# EAGLE design KDAC (EAGLE 9.6.2)
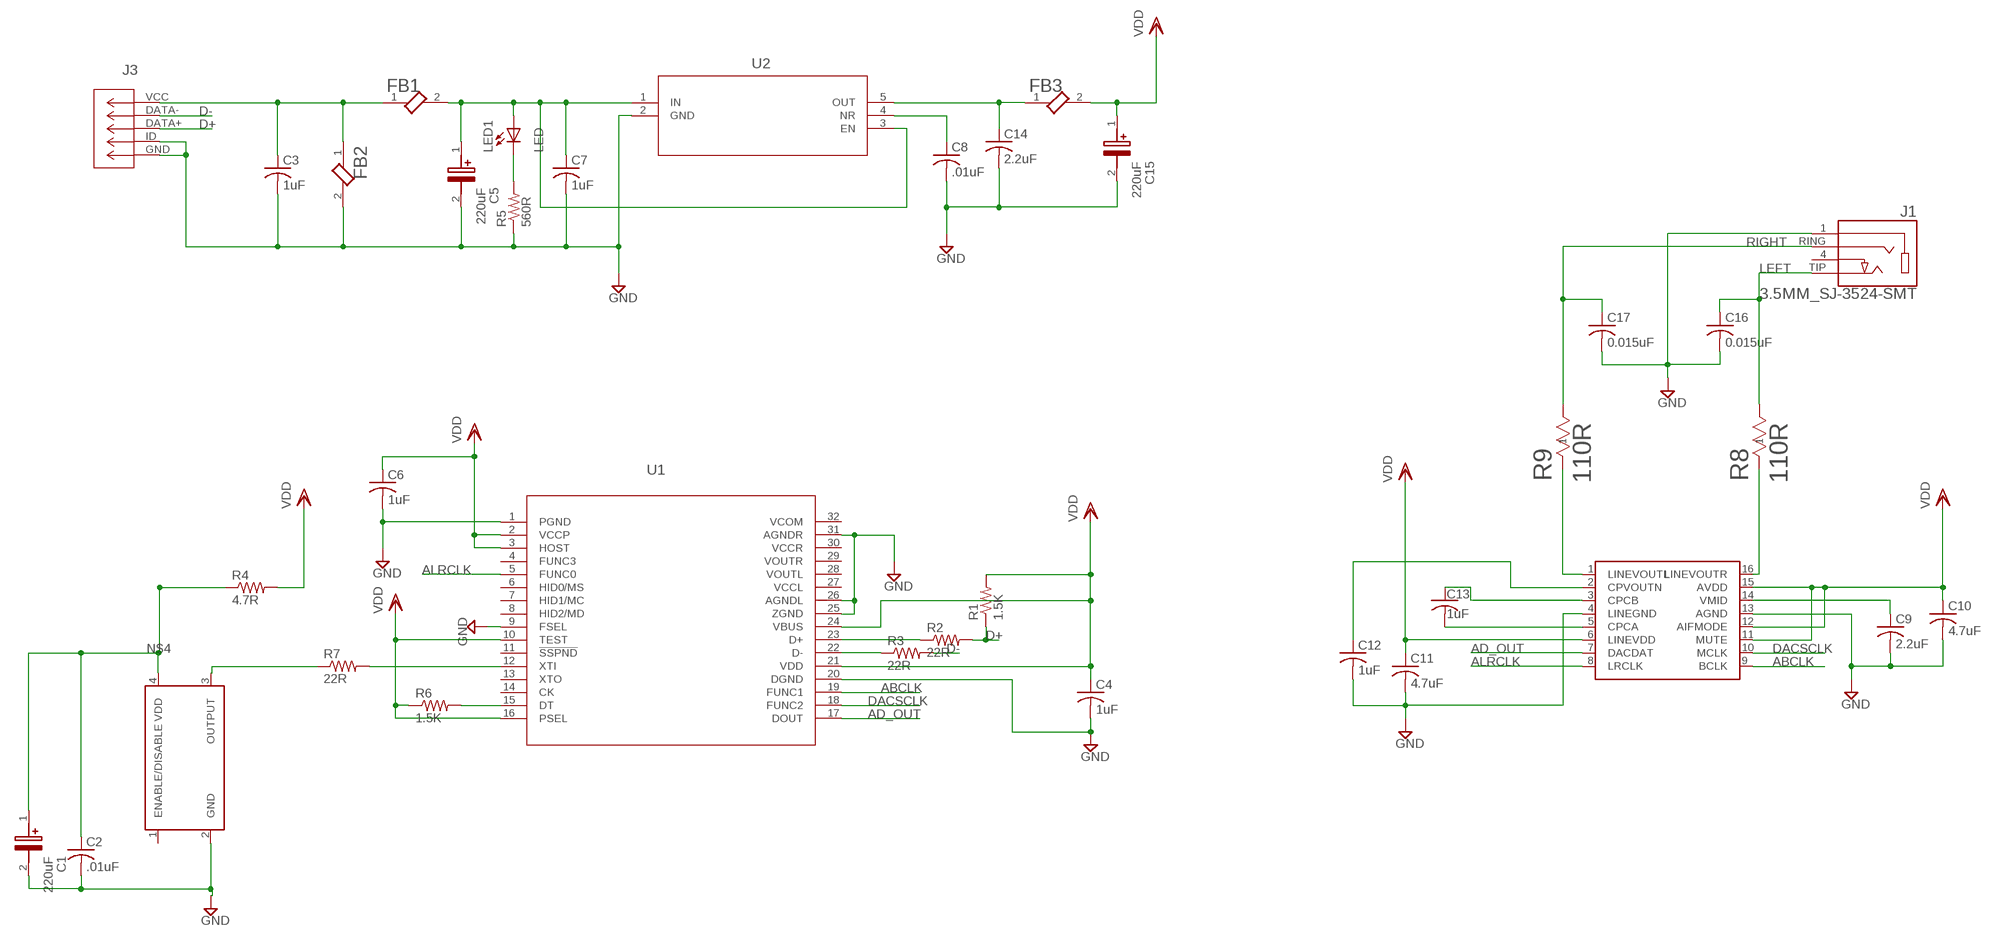
[diagram p0: schematic, sheet 1]

## Parts
C1  220uF  EEE-1VA221UP  [CAPAE830X1050N]
C2  .01uF  C-USC0805  [C0805]
C3  1uF  C-USC0805  [C0805]
C4  1uF  C-USC0805  [C0805]
C5  220uF  EEE-1VA221UP  [CAPAE830X1050N]
C6  1uF  C-USC0805  [C0805]
C7  1uF  C-USC0805  [C0805]
C8  .01uF  C-USC0805  [C0805]
C9  2.2uF  C-USC0805  [C0805]
C10  4.7uF  C-USC0805  [C0805]
C11  4.7uF  C-USC0805  [C0805]
C12  1uF  C-USC0805  [C0805]
C13  1uF  C-USC0805  [C0805]
C14  2.2uF  C-USC0805  [C0805]
C15  220uF  EEE-1VA221UP  [CAPAE830X1050N]
C16  0.015uF  C-US050-075X075  [C050-075X075]
C17  0.015uF  C-US050-075X075  [C050-075X075]
FB1  L_MURATA_BLM31PG601SN1LMURATA_BLM31PG601SN1L_0_2  [MURATA_BLM31PG601SN1L_2]
FB2  L_MURATA_BLM31PG601SN1LMURATA_BLM31PG601SN1L_0_2  [MURATA_BLM31PG601SN1L_2]
FB3  L_MURATA_BLM31PG601SN1LMURATA_BLM31PG601SN1L_0_2  [MURATA_BLM31PG601SN1L_2]
J1  3.5MM_SJ-3524-SMT  [CUI_SJ-3524-SMT]
J3  USB-MICRO-B_10118192-0002LF  [CONN_10118192-0002LF_AMP]
LED1  LED  [LED_2.54MM_0.5MM]
R1  1.5K  R-US_R1206  [R1206]
R2  22R  R-US_R1206  [R1206]
R3  22R  R-US_R1206  [R1206]
R4  4.7R  R-US_R1206  [R1206]
R5  560R  R-US_R1206  [R1206]
R6  1.5K  R-US_R1206  [R1206]
R7  22R  R-US_R1206  [R1206]
R8  110R  R_CMF50110R00FHEB  [RES_CMF50]
R9  110R  R_CMF50110R00FHEB  [RES_CMF50]
U1  PCM2706CPJTRPJT32-M  [PJT32-M]
U2  TPS79333DBVRDBV5_TEX-M  [DBV5_TEX-M]
U3  WM8524ALT  [SOP65P640X110-16N]
X1  ASV-12MHZ  [ASV_12MHZ_4SMD-M]

## Nets
ABCLK [Signal]: U1.19(FUNC1) U3.9(BCLK)
AD_OUT [Signal]: U1.17(DOUT) U3.7(DACDAT)
ALRCLK [Signal]: U1.5(FUNC0) U3.8(LRCLK)
D+ [Signal]: J3.DATA+ R1.1 R2.2
D- [Signal]: J3.DATA- R3.2
DACSCLK [Signal]: U1.18(FUNC2) U3.10(MCLK)
GND [PWR]: C1.2(-) C2.2 C3.2 C4.2 C5.2(-) C6.2 C7.2 C8.2 C9.2 C10.2 C11.2 C12.2 C14.2 C15.2(-) C16.2 C17.2 FB2.2 J1.1 J3.GND J3.ID R5.1 U1.1(PGND) U1.9(FSEL) U1.20(DGND) U1.25(ZGND) U1.26(AGNDL) U1.31(AGNDR) U2.2(GND) U3.4(LINEGND) U3.13(AGND) X1.2(GND)
LEFT [PWR]: C16.1 J1.TIP R8.2
N$1: C3.1 FB1.1 FB2.1 J3.VCC
N$2 [Signal]: C14.1 FB3.1 U2.5(OUT)
N$3 [Signal]: C5.1(+) C7.1 FB1.2 LED1.ANODE(+) U2.1(IN) U2.3(EN)
N$4 [Signal]: C1.1(+) C2.1 R4.1 X1.4(VDD)
N$5 [Signal]: R7.2 U1.12(XTI)
N$6 [Signal]: R7.1 X1.3(OUTPUT)
N$7 [Signal]: LED1.CATHODE(-) R5.2
N$8 [Signal]: C8.1 U2.4(NR)
N$9 [Signal]: R6.2 U1.15(DT)
N$10 [Signal]: R3.1 U1.22(D-)
N$11 [Signal]: R2.1 U1.23(D+)
N$12 [Signal]: C13.1 U3.3(CPCB)
N$13 [Signal]: C12.1 U3.2(CPVOUTN)
N$14 [Signal]: C9.1 U3.14(VMID)
N$15 [Signal]: C13.2 U3.5(CPCA)
N$16 [PWR]: R9.1 U3.1(LINEVOUTL)
N$17 [PWR]: R8.1 U3.16(LINEVOUTR)
RIGHT [PWR]: C17.1 J1.RING R9.2
VDD [PWR]: C4.1 C6.1 C10.1 C11.1 C15.1(+) FB3.2 R1.2 R4.2 R6.1 U1.2(VCCP) U1.3(HOST) U1.10(TEST) U1.16(PSEL) U1.21(VDD) U1.24(VBUS) U3.6(LINEVDD) U3.11(MUTE) U3.12(AIFMODE) U3.15(AVDD)
Unconnected: J1.4 U1.4(FUNC3) U1.6(HID0/MS) U1.7(HID1/MC) U1.8(HID2/MD) U1.11(!SSPND) U1.13(XTO) U1.14(CK) U1.28(VOUTL) U1.29(VOUTR) X1.1(ENABLE/DISABLE)

## Power pins joined to a net without a drawn wire
VCCL: U1.27(VCCL)
VCCR: U1.30(VCCR)
VCOM: U1.32(VCOM)

## Library data of the parts
C1 C5 C15 = GrubDAC:EEE-1VA221UP: PANASONIC ELECTRONIC COMPONENTS - EEE-1VA221UP - ALUMINUM ELECTROLYTIC CAPACITOR, 220UF, 35V, 20%, SMD Source: Datasheet <http://www.farnell.com/datasheets/1909355.pdf?_ga=1.185853408.878552343.1493119789>; ARROW_PART_NUMBER: EEE-1VA221UP; ARROW_PRICE-STOCK: https://www.arrow.com/en/products/eee1va221up/panasonic; DESCRIPTION: PANASONIC ELECTRONIC COMPONENTS - EEE-1VA221UP - ALUMINUM ELECTROLYTIC CAPACITOR, 220UF, 35V, 20%, SMD; HEIGHT: 10.5mm; MANUFACTURER_NAME: Panasonic; MANUFACTURER_PART_NUMBER: EEE-1VA221UP; MOUSER_PART_NUMBER: 667-EEE-1VA221UP; MOUSER_PRICE-STOCK: https://www.mouser.co.uk/ProductDetail/Panasonic/EEE-1VA221UP?qs=wEytwf7f49HAk5ZYHhDyew%3D%3D
C2-C4 C6-C14 C16 C17 = GrubDAC:C-US: CAPACITOR, American symbol
FB1-FB3 = GrubDAC:L_MURATA_BLM31PG601SN1L: Ferrite Beads Multi-Layer 600Ohm 25% 100MHz 1.5A 80mOhm DCR 1206 Embossed T/R; 3DS_PART_NUMBER: 310-00005; AUTOMOTIVE: No; CENTROID_NOT_SPECIFIED: No; CORE_MATERIAL: Ferrite; DATASHEET: https://www.murata.com/en-us/products/productdata/8796739698718/ENFA0006.pdf; DEVICE_CLASS_L1: Passive Components; DEVICE_CLASS_L2: EMI / RFI Components; DEVICE_CLASS_L3: Ferrite Beads and Chips; DIGIKEY_DESCRIPTION: FBEAD FERRITE BEAD 600 OHM 1206 1LN; DIGIKEY_PART_NUMBER: 490-1057-1-ND; FOOTPRINT_PARAMETERS_0: {"fp_type":"chip_res","params":{"L":{"nom":3200000,"long name":"Length","min":3000000,"max":3400000,"short name":"L","type":"measurement"},"W":{"nom":1600000,"long name":"Width","min":1400000,"max":1800000,"short name":"W","type":"measurement"},"t":{"nom":1100000,"long name":"Height","min":900000,"max":1300000,"short name":"t","type":"measurement"},"b":{"nom":700000,"long name":"Terminal width","min":400000,"max":1000000,"short name":"b","type":"measurement"},"P":{"default":"false","long name":"Polarized","type":"multichoice","short name":"P"},"offset x":{"nom":0,"long name":"X Center offset","min":null,"max":null,"short name":"offset x","type":"measurement"},"offset y":{"nom":0,"long name":"Y Center offset","min":null,"max":null,"short name":"offset y","type":"measurement"},"LS":{"long name":"Land shape","type":"fixed","short name":"LS","value":"Rectangle"},"solder toe":{"nom":550000,"long name":"Solder fillet (toe)","min":null,"max":null,"short name":"solder toe","type":"fixedmeasurement"},"solder heel":{"nom":-50000,"long name":"Solder fillet (heel)","min":null,"max":null,"short name":"solder heel","type":"fixedmeasurement"},"solder side":{"nom":50000,"long name":"Solder fillet (side)","min":null,"max":null,"short name":"solder side","type":"fixedmeasurement"},"courtyard":{"nom":500000,"long name":"Courtyard","min":null,"max":null,"short name":"courtyard","type":"fixedmeasurement"},"SF":{"default":"A (>= 1608 metric)","long name":"Packing level","type":"multichoiceparent","short name":"SF","help":"http://support.upverter.com/customer/portal/articles/978783-what-is-a-footprint-packing-level","children":["solder toe","solder heel","solder side","courtyard"]}}}; FOOTPRINT_PARAMETERS_1: {"fp_type":"chip_res","params":{"L":{"nom":3200000,"long name":"Length","min":3000000,"max":3400000,"short name":"L","type":"measurement"},"W":{"nom":1600000,"long name":"Width","min":1400000,"max":1800000,"short name":"W","type":"measurement"},"t":{"nom":1100000,"long name":"Height","min":900000,"max":1300000,"short name":"t","type":"measurement"},"b":{"nom":700000,"long name":"Terminal width","min":400000,"max":1000000,"short name":"b","type":"measurement"},"P":{"default":"false","long name":"Polarized","type":"multichoice","short name":"P"},"offset x":{"nom":0,"long name":"X Center offset","min":null,"max":null,"short name":"offset x","type":"measurement"},"offset y":{"nom":0,"long name":"Y Center offset","min":null,"max":null,"short name":"offset y","type":"measurement"},"LS":{"long name":"Land shape","type":"fixed","short name":"LS","value":"Rectangle"},"solder toe":{"nom":550000,"long name":"Solder fillet (toe)","min":null,"max":null,"short name":"solder toe","type":"fixedmeasurement"},"solder heel":{"nom":0,"long name":"Solder fillet (heel)","min":null,"max":null,"short name":"solder heel","type":"fixedmeasurement"},"solder side":{"nom":50000,"long name":"Solder fillet (side)","min":null,"max":null,"short name":"solder side","type":"fixedmeasurement"},"courtyard":{"nom":500000,"long name":"Courtyard","min":null,"max":null,"short name":"courtyard","type":"fixedmeasurement"},"SF":{"default":"A (>= 1608 metric)","long name":"Packing level","type":"multichoiceparent","short name":"SF","help":"http://support.upverter.com/customer/portal/articles/978783-what-is-a-footprint-packing-level","children":["solder toe","solder heel","solder side","courtyard"]}}}; FOOTPRINT_PARAMETERS_2: {"fp_type":"chip_res","params":{"L":{"nom":3200000,"long name":"Length","min":3000000,"max":3400000,"short name":"L","type":"measurement"},"W":{"nom":1600000,"long name":"Width","min":1400000,"max":1800000,"short name":"W","type":"measurement"},"t":{"nom":1100000,"long name":"Height","min":900000,"max":1300000,"short name":"t","type":"measurement"},"b":{"nom":700000,"long name":"Terminal width","min":400000,"max":1000000,"short name":"b","type":"measurement"},"P":{"default":"false","long name":"Polarized","type":"multichoice","short name":"P"},"offset x":{"nom":0,"long name":"X Center offset","min":null,"max":null,"short name":"offset x","type":"measurement"},"offset y":{"nom":0,"long name":"Y Center offset","min":null,"max":null,"short name":"offset y","type":"measurement"},"LS":{"long name":"Land shape","type":"fixed","short name":"LS","value":"Rectangle"},"solder toe":{"nom":350000,"long name":"Solder fillet (toe)","min":null,"max":null,"short name":"solder toe","type":"fixedmeasurement"},"solder heel":{"nom":0,"long name":"Solder fillet (heel)","min":null,"max":null,"short name":"solder heel","type":"fixedmeasurement"},"solder side":{"nom":0,"long name":"Solder fillet (side)","min":null,"max":null,"short name":"solder side","type":"fixedmeasurement"},"courtyard":{"nom":250000,"long name":"Courtyard","min":null,"max":null,"short name":"courtyard","type":"fixedmeasurement"},"SF":{"default":"B (>= 1608 metric)","long name":"Packing level","type":"multichoiceparent","short name":"SF","help":"http://support.upverter.com/customer/portal/articles/978783-what-is-a-footprint-packing-level","children":["solder toe","solder heel","solder side","courtyard"]}}}; FOOTPRINT_PARAMETERS_3: {"fp_type":"chip_res","params":{"L":{"nom":3200000,"long name":"Length","min":3000000,"max":3400000,"short name":"L","type":"measurement"},"W":{"nom":1600000,"long name":"Width","min":1400000,"max":1800000,"short name":"W","type":"measurement"},"t":{"nom":1100000,"long name":"Height","min":900000,"max":1300000,"short name":"t","type":"measurement"},"b":{"nom":700000,"long name":"Terminal width","min":400000,"max":1000000,"short name":"b","type":"measurement"},"P":{"default":"false","long name":"Polarized","type":"multichoice","short name":"P"},"offset x":{"nom":0,"long name":"X Center offset","min":null,"max":null,"short name":"offset x","type":"measurement"},"offset y":{"nom":0,"long name":"Y Center offset","min":null,"max":null,"short name":"offset y","type":"measurement"},"LS":{"long name":"Land shape","type":"fixed","short name":"LS","value":"Rectangle"},"solder toe":{"nom":150000,"long name":"Solder fillet (toe)","min":null,"max":null,"short name":"solder toe","type":"fixedmeasurement"},"solder heel":{"nom":0,"long name":"Solder fillet (heel)","min":null,"max":null,"short name":"solder heel","type":"fixedmeasurement"},"solder side":{"nom":-50000,"long name":"Solder fillet (side)","min":null,"max":null,"short name":"solder side","type":"fixedmeasurement"},"courtyard":{"nom":100000,"long name":"Courtyard","min":null,"max":null,"short name":"courtyard","type":"fixedmeasurement"},"SF":{"default":"C (>= 1608 metric)","long name":"Packing level","type":"multichoiceparent","short name":"SF","help":"http://support.upverter.com/customer/portal/articles/978783-what-is-a-footprint-packing-level","children":["solder toe","solder heel","solder side","courtyard"]}}}; FOOTPRINT_VARIANT_NAME_0: Recommended_Land_Pattern; FOOTPRINT_VARIANT_NAME_1: IPC_A; FOOTPRINT_VARIANT_NAME_2: IPC_B; FOOTPRINT_VARIANT_NAME_3: IPC_C; HEIGHT: 1.3mm; IMPEDANCE_AT_FREQUENCY: 600Ω @ 100MHz; IPC_LAND_PATTERN_NAME: CAPC320160X110; LEAD_FREE: Yes; MF: Murata; MFG_PACKAGE_IDENT: BLM31PG; MFG_PACKAGE_IDENT_DATE: 0; MFG_PACKAGE_IDENT_REV: 0; MOUSER_PART_NUMBER: 81-BLM31PG601SN1; MPN: BLM31PG601SN1L; PACKAGE: 1206; PREFIX: FB; RMS_CURRENT: 1.5A; ROHS: Yes; SERIES_RESISTANCE: 0.08Ω; TEMPERATURE_RANGE_HIGH: +125°C; TEMPERATURE_RANGE_LOW: -55°C; TEST_FREQUENCY: 100MHz; TOLERANCE: 25%; VERIFICATION_VERSION: 0.0.0.2
J1 = GrubDAC:3.5MM_SJ-3524-SMT: Audio Jack Connector 3.5 mm Low Profile Surface Mount Stereo Jack, 4 Pin Right-Angle; MF: CUI Inc; PARTREV: 1.03; STANDARD: Manufacturer recommendations
J3 = GrubDAC:USB-MICRO-B_10118192-0002LF; BUILT_BY: EMA_Cory; COPYRIGHT: Copyright (C) 2018 Accelerated Designs. All rights reserved; DATASHEET: https://www.amphenol-icc.com/media/wysiwyg/files/drawing/10118192.pdf; MANUFACTURER_PART_NUMBER: 10118192-0002LF; SOURCELIBRARY: Amphenol_ICC_2020-05-19; VENDOR: Amphenol
LED1 = GrubDAC:LED
R1-R7 = GrubDAC:R-US_: RESISTOR, American symbol
R8 R9 = GrubDAC:R_CMF50110R00FHEB; BUILT_BY: EMA_UL_Team; MANUFACTURER_PART_NUMBER: CMF50110R00FHEB; VENDOR: Vishay
U1 = GrubDAC:PCM2706CPJTR; BUILT_BY: EMA_UL_Team; MANUFACTURER: Texas Instruments; MANUFACTURER_PART_NUMBER: PCM2706CPJTR; VENDOR: Texas Instruments
U2 = GrubDAC:TPS79333DBVR; BUILT_BY: EMA_UL_Team; MANUFACTURER: Texas Instruments; MANUFACTURER_PART_NUMBER: TPS79333DBVR; SOURCELIBRARY: TI_2014-06-19; VENDOR: Texas Instruments
U3 = GrubDAC:WM8524
X1 = GrubDAC:ASV-12MHZ

## Net classes
0 default: width 0.203 mm, clearance 0.178 mm
1 Signal: width 0.203 mm, clearance 0.178 mm
2 PWR: width 0.406 mm, clearance 0.178 mm

## Board
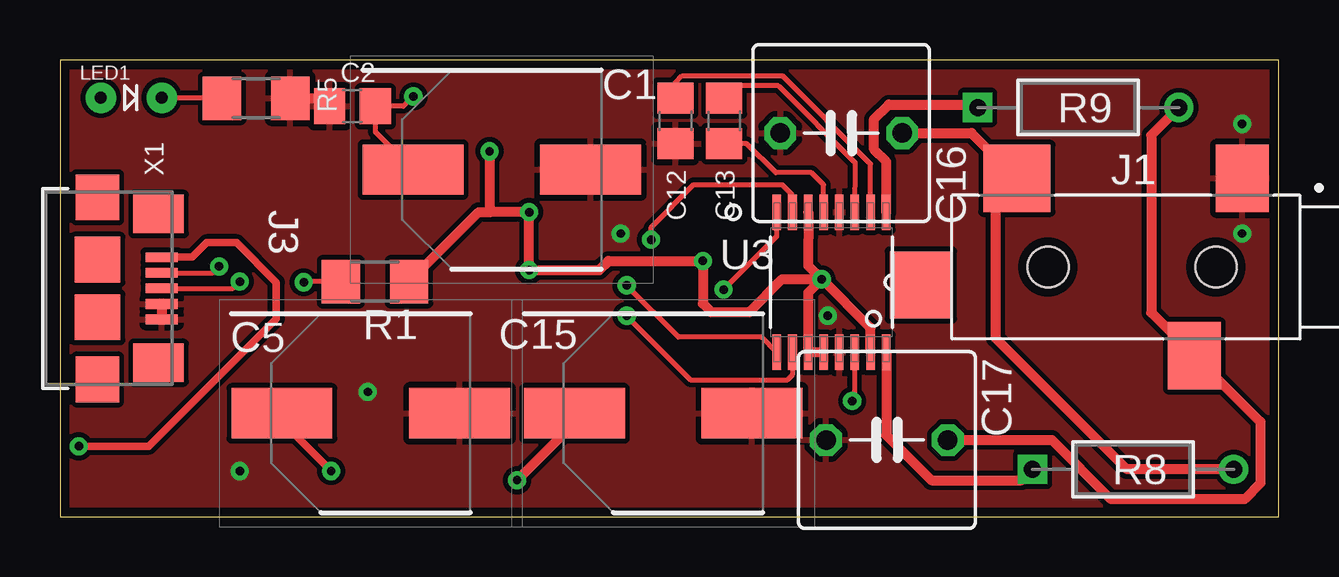
[diagram p1: board, top side]
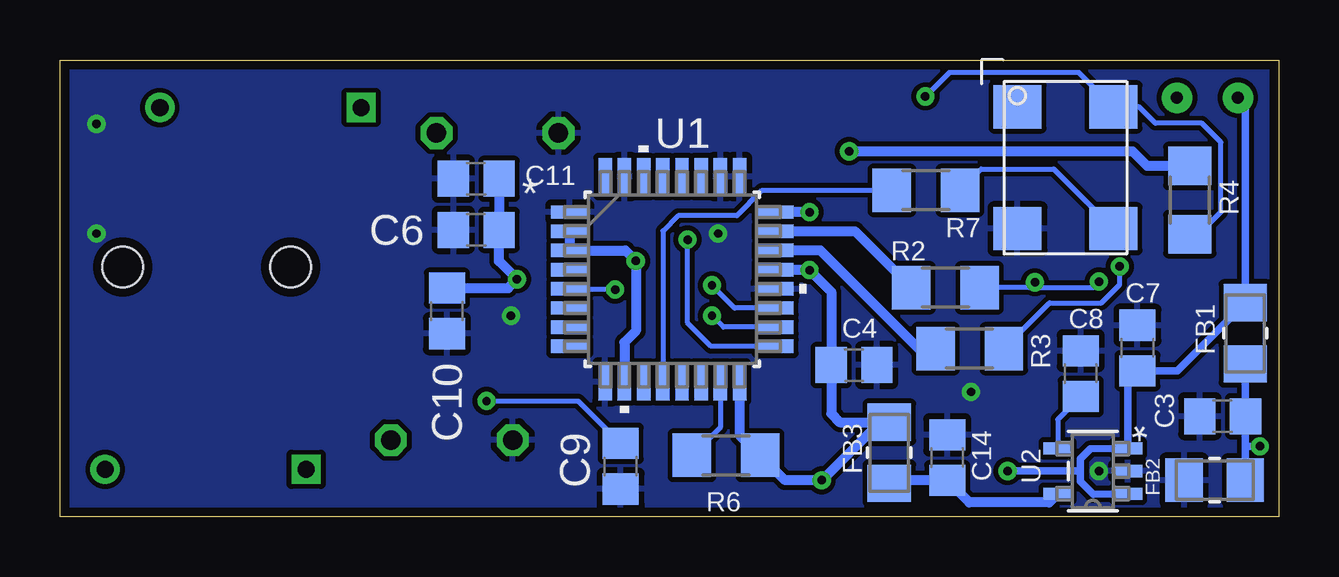
[diagram p2: board, bottom side, seen from below]

Size 50.8 x 19.05 mm. Coordinates in mm from the lower left corner, seen from the top.
Outline: 0,0 50.8,0 50.8,19.05 0,19.05 0,0
Copper layers (1*16): Top 0.035mm / dielectric 1.5mm / Bottom 0.035mm
Design rules "GrubDAC": minimum track width 8mil, minimum drill 10mil, track to track 8mil, track to pad 8mil, pad to pad 8mil, via to via 8mil, smd to smd 0mil, copper to edge 15mil, drill to drill 8mil, minimum pad ring 10mil, minimum via ring 8mil, stop-mask expansion 4mil, vias tented up to drill 0mil, thermal gap 10mil

### Footprints (pad centres in the part's own frame; a part is rotated, then mirrored left to right if it is on the bottom)
CAPAE830X1050N = smd 4.2 x 2.1: 1 -3.7,0; 2 3.7,0
C0805 = smd 1.3 x 1.5: 1 -0.95,0; 2 0.95,0
C050-075X075 = drill 0.813 octagon: 1 -2.54,0; 2 2.54,0
MURATA_BLM31PG601SN1L_2 = smd 1.554 x 1.806: 1 -1.276,0; 2 1.276,0
CUI_SJ-3524-SMT = smd 2.2 x 2.8: 1 -1.1,-3.7; RING 0.9,3.7 | smd 2.6 x 2.8: 4 12.3,0.75 | smd 2.8 x 2.8: TIP 8.3,-3.7 | hole 1.7: 0,0; 7,0
CONN_10118192-0002LF_AMP = smd 1.6 x 2.108: 6 -3.1,2.079; 7 3.1,2.079 | smd 1.905 x 1.803: 8 -3.8,-0.471; 9 3.8,-0.471 | smd 1.905 x 1.905: 10 -1.2,-0.471; 11 1.2,-0.471 | smd 0.406 x 1.346: DATA+ 0,2.204; DATA- -0.65,2.204; GND 1.3,2.204; ID 0.65,2.204; VCC -1.3,2.204
LED_2.54MM_0.5MM = drill 0.5 pad 1.27: ANODE 0,0; CATHODE 2.54,0
R1206 = smd 1.6 x 1.803: 1 -1.422,0; 2 1.422,0
RES_CMF50 = drill 0.711 pad 1.219 square: 1 -8.382,0 | drill 0.711 pad 1.219: 2 0,0
PJT32-M = smd 1.549 x 0.559: 1 -4.28,2.8; 2 -4.28,2; 3 -4.28,1.2; 4 -4.28,0.4; 5 -4.28,-0.4; 6 -4.28,-1.2; 7 -4.28,-2; 8 -4.28,-2.8; 17 4.28,-2.8; 18 4.28,-2; 19 4.28,-1.2; 20 4.28,-0.4; 21 4.28,0.4; 22 4.28,1.2; 23 4.28,2; 24 4.28,2.8 | smd 0.559 x 1.549: 9 -2.8,-4.28; 10 -2,-4.28; 11 -1.2,-4.28; 12 -0.4,-4.28; 13 0.4,-4.28; 14 1.2,-4.28; 15 2,-4.28; 16 2.8,-4.28; 25 2.8,4.28; 26 2,4.28; 27 1.2,4.28; 28 0.4,4.28; 29 -0.4,4.28; 30 -1.2,4.28; 31 -2,4.28; 32 -2.8,4.28
DBV5_TEX-M = smd 1.181 x 0.508: 1 -1.467,0.95; 2 -1.467,0; 3 -1.467,-0.95; 4 1.467,-0.95; 5 1.467,0.95
SOP65P640X110-16N = smd 1.473 x 0.356: 1 -2.921,2.286; 2 -2.921,1.626; 3 -2.921,0.965; 4 -2.921,0.33; 5 -2.921,-0.33; 6 -2.921,-0.965; 7 -2.921,-1.626; 8 -2.921,-2.286; 9 2.921,-2.286; 10 2.921,-1.626; 11 2.921,-0.965; 12 2.921,-0.33; 13 2.921,0.33; 14 2.921,0.965; 15 2.921,1.626; 16 2.921,2.286
ASV_12MHZ_4SMD-M = smd 1.8 x 2: 1 -2.54,-2; 2 2.54,-2; 3 2.54,2; 4 -2.54,2

### Placement (x,y rotation side)
C1  18.41,14.48 0 top
C2  12.19,17.12 180 top
C3  2.34,4.19 180 bottom
C4  17.7,6.32 0 bottom
C5  12.95,4.32 0 top
C6  33.45,11.96 180 bottom
C7  5.89,7.04 90 bottom
C8  8.26,5.97 90 bottom
C9  27.43,2.11 270 bottom
C10  34.67,8.59 270 bottom
C11  33.45,14.1 180 bottom
C12  25.65,16.51 270 top
C13  27.69,16.51 270 top
C14  13.82,2.46 90 bottom
C15  25.15,4.32 0 top
C16  32.56,16 180 top
C17  34.47,3.2 180 top
FB1  1.4,7.65 90 bottom
FB2  2.67,1.52 180 bottom
FB3  16.23,2.67 90 bottom
J1  48.18,10.41 180 top
J3  2.03,9.53 270 top
LED1  1.7,17.48 0 top
R1  13.13,9.8 0 top
R2  13.89,9.55 0 bottom
R3  12.88,7.01 0 bottom
R4  3.71,13.21 90 bottom
R5  8.18,17.45 180 top
R6  23.04,2.57 180 bottom
R7  14.71,13.61 180 bottom
R8  48.92,1.98 0 top
R9  46.63,17.07 0 top
U1  25.27,9.91 0 bottom
U2  7.75,1.91 180 bottom
U3  32.16,9.78 270 top
X1  8.89,14.55 270 bottom

### Tracks (layer width: path | path; a pad name or v marks a point on that pad's centre or on a via)
ABCLK  (via drill 0.35)
  Top 0.203: v23.62,9.65 25.78,7.49 29.23,7.49 U3.9
  Bottom 0.203: U1.19 22.68,8.71 v23.62,9.65
AD_OUT  (via drill 0.35)
  Top 0.203: v24.64,11.56 24.64,12.06 26.42,13.84 30.1,13.84 30.53,13.41 U3.7
  Bottom 0.203: v24.64,11.56 24.64,8.09 23.66,7.11 U1.17
ALRCLK  (via drill 0.35)
  Top 0.203: U3.8 29.88,11.69 v27.66,9.47
  Bottom 0.203: v27.66,9.47 27.69,9.51 U1.5
D+  (via drill 0.35)
  Top 0.203: J3.DATA+ 7.21,9.53 v7.49,9.8 | R1.1 10.19,9.8 v10.16,9.78
  Bottom 0.203: v7.49,9.8 7.75,9.55 9.93,9.55 v10.16,9.78 10.39,9.55 R2.2
D-  (via drill 0.35)
  Top 0.203: J3.DATA- 6.37,10.18 v6.63,10.44
  Bottom 0.203: R3.2 9.55,8.91 7.39,8.91 6.63,9.68 v6.63,10.44
DACSCLK  (via drill 0.35)
  Top 0.203: U3.10 30.53,5.92 30.32,5.71 26.29,5.71 v23.62,8.38
  Bottom 0.203: U1.18 23.15,7.91 v23.62,8.38
GND  (via drill 0.35)
  Top 0.406: J3.ID J3.GND | R5.1 10.91,17.45 C2.2
  other vias: 7.49,1.91 23.37,11.81 12.83,5.21 32,8.38 49.28,11.81 49.28,16.38
  pour Top: -1.83,27.43 78.79,27.13 78.79,-1.83 -1.83,-1.37
  pour Bottom: 77.42,26.52 -1.22,26.67 -1.07,-1.37 77.57,-1.22
LEFT
  Top 0.406: C16.1 38,16 J1.TIP 38.99,13.22 38.99,7.46 44.48,1.98 R8.2
N$1  (via drill 0.35)
  Top 0.305: v0.78,2.94 3.7,2.94 9.02,8.26 9.02,9.78 7.37,11.43 6.11,11.43 5.51,10.82 J3.VCC
  Bottom 0.305: 1.39,2.94 C3.1 FB1.1 | 1.39,2.94 FB2.1 | v0.78,2.94 1.39,2.94
N$2
  Bottom 0.406: FB3.1 16.11,1.51 C14.1 12.9,0.6 9.57,0.6 U2.5
N$3  (via drill 0.35)
  Top 0.305: v11.3,1.91 9.25,3.95 C5.1
  Bottom 0.305: 8.27,1.91 8.27,2.42 7.86,2.83 U2.3 6.28,5.7 C7.1 4.23,6.09 FB1.2 1.4,17.17 LED1.ANODE | 8.27,1.91 8.27,1.47 7.73,0.93 U2.1 | v11.3,1.91 8.27,1.91
N$4  (via drill 0.35)
  Top 0.203: v14.73,17.53 14.32,17.12 C2.1 13.14,16.05 C1.1
  Bottom 0.203: X1.4 8.32,18.53 13.73,18.53 v14.73,17.53 | 6.84,17.15 X1.4 | R4.1 3.33,11.79 2.41,12.7 2.41,15.62 3.2,16.41 5.14,16.41 5.83,17.09 X1.4
N$5
  Bottom 0.203: R7.2 21.53,13.61 22.59,12.56 25.03,12.56 25.67,11.92 U1.12
N$6
  Bottom 0.203: X1.3 9.38,14.5 12.4,14.5 R7.1
N$7
  Top 0.203: LED1.CATHODE 6.73,17.48 R5.2
N$8
  Bottom 0.203: C8.1 9.21,4.06 U2.4
N$9
  Bottom 0.203: U1.15 23.27,3.73 R6.2
N$10
  Bottom 0.406: R3.1 15.02,7.01 19.11,11.11 U1.22
N$11
  Bottom 0.406: U1.23 17.67,11.91 R2.1
N$12
  Top 0.203: C13.1 28.19,17.97 29.94,17.97 33.14,14.78 U3.3
N$13
  Top 0.203: C12.1 25.65,18.11 25.93,18.39 30.11,18.39 33.78,14.71 U3.2
N$14  (via drill 0.35)
  Top 0.203: U3.14 33.12,4.93 v33.02,4.83
  Bottom 0.203: v33.02,4.83 29.2,4.83 C9.1
N$15
  Top 0.203: C13.2 28.62,15.56 29.83,14.35 31.32,14.35 31.83,13.84 U3.5
N$16
  Top 0.406: R9.1 38.12,17.2 34.54,17.2 33.93,16.59 33.93,15.32 34.44,14.81 U3.1
N$17
  Top 0.406: U3.16 34.44,3.4 36.32,1.52 40.08,1.52 R8.1
RIGHT
  Top 0.406: C17.1 41.35,3.2 43.81,0.74 49.38,0.74 50.04,1.4 50.04,3.96 J1.RING 45.48,8.52 45.48,15.91 R9.2
VDD  (via drill 0.35)
  Top 0.406: 17.91,12.7 v19.56,12.7 v19.56,10.29 22.48,10.29 22.86,10.67 v26.8,10.67 26.8,8.89 27.15,8.54 28.73,8.54 30.1,9.91 v31.75,9.91 | U3.15 33.78,7.87 v31.75,9.91 | U3.12 U3.11 31.19,9.35 v31.75,9.91 | U3.6 31.18,10.47 v31.75,9.91 | v19.05,1.52 21.45,3.92 C15.1 | v17.91,15.24 17.91,12.7 | R1.2 17.45,12.7 17.91,12.7
  Bottom 0.406: U1.16 22.47,3.4 R6.1 20.57,1.52 v19.05,1.52 16.63,3.94 FB3.2 18.29,3.94 18.65,4.3 C4.1 18.65,9.38 v19.56,10.29 20.97,10.29 U1.21 | v19.56,12.7 U1.24 | U1.2 U1.3 27.23,11.11 v26.8,10.67 26.8,7.75 27.27,7.28 U1.10 | v17.91,15.24 6.1,15.24 5.49,14.63 R4.2 | C11.1 C6.1 32.5,10.66 v31.75,9.91 32.12,9.54 C10.1

### Text on the board
tPlace: X1